# Altium schematic sheet Main.SchDoc: =DocumentName
size A4; SheetNumber: 1; SheetTotal: 5
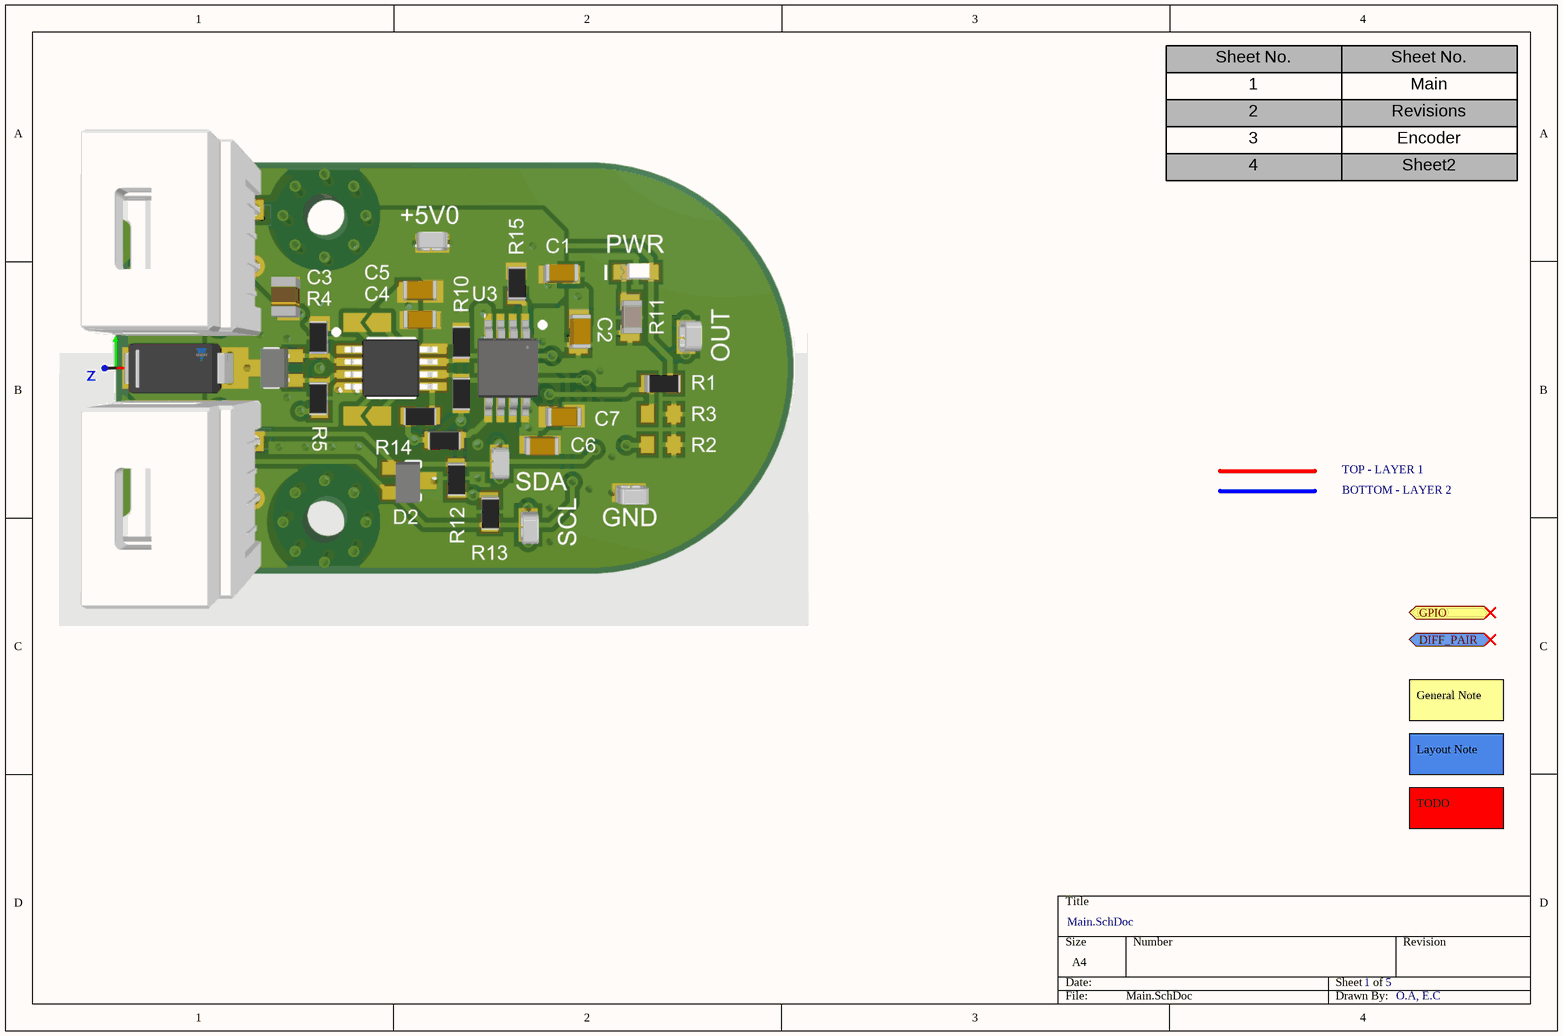
[diagram p0: Main.SchDoc]

## Ports
DIFF_PAIR (bidir), GPIO (bidir)

## Notes on the sheet
- Sheet No.
- 1
- Main
- 2
- 3
- 4
- Revisions
- Encoder
- Sheet2
- TOP - LAYER 1
- BOTTOM - LAYER 2
- General Note
- Layout Note
- TODO
- O.A, E.C